# Altium schematic sheet 13-USB_HS.SchDoc
size B; SheetNumber: 13; SheetTotal: 16
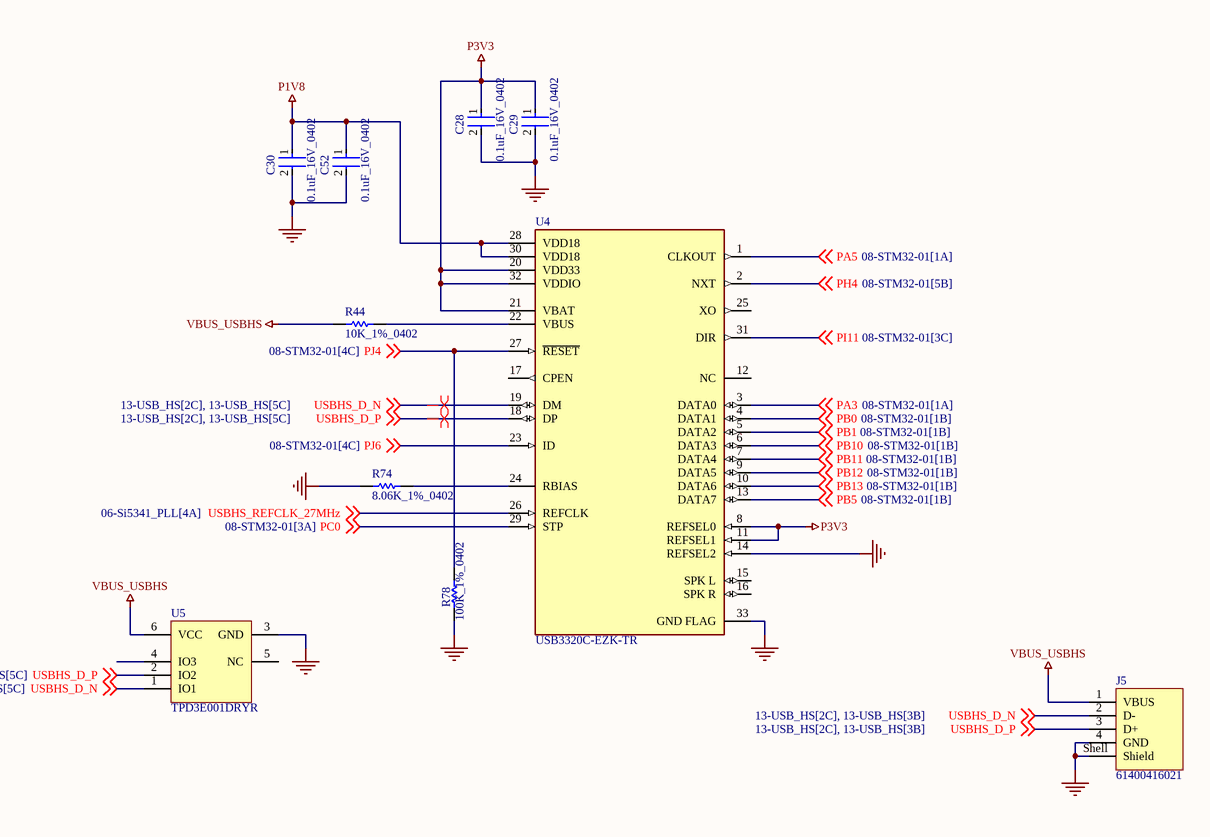
[diagram p0: 13-USB_HS.SchDoc]

## Parts
C28  0.1uF_16V_0402  [FP-C0402-BB-MFG]
C29  0.1uF_16V_0402  [FP-C0402-BB-MFG]
C30  0.1uF_16V_0402  [FP-C0402-BB-MFG]
C52  0.1uF_16V_0402  [FP-C0402-BB-MFG]
J5  61400416021  [61400416021]
R44  10K_1%_0402  [RESC1005X40X25NL10T10]
R74  8.06K_1%_0402  [RESC1005X40X25LL05T05]
R78  100K_1%_0402  [RESC1005X40X25ML05T10]
U4  USB3320C-EZK-TR  [FP-32QFN-3304-5X5B-MFG]
U5  TPD3E001DRYR  [DRY0006A]

## Nets
GND: C28.2 C29.2 C30.2 C52.2 J5.4(GND) J5.Shell(Shield) R74.1 R78.1 U4.14(REFSEL2) U4.33(GND_FLAG) U5.3(GND)
P1V8: C30.1 C52.1 U4.28(VDD18) U4.30(VDD18)
P3V3: C28.1 C29.1 U4.8(REFSEL0) U4.11(REFSEL1) U4.20(VDD33) U4.21(VBAT) U4.32(VDDIO)
VBUS_USBHS: J5.1(VBUS) R44.2 U5.6(VCC)
PA3: U4.3(DATA0) ; off-sheet PA3
PA5: U4.1(CLKOUT) ; off-sheet PA5
PB0: U4.4(DATA1) ; off-sheet PB0
PB1: U4.5(DATA2) ; off-sheet PB1
PB5: U4.13(DATA7) ; off-sheet PB5
PB10: U4.6(DATA3) ; off-sheet PB10
PB11: U4.7(DATA4) ; off-sheet PB11
PB12: U4.9(DATA5) ; off-sheet PB12
PB13: U4.10(DATA6) ; off-sheet PB13
PC0: U4.29(STP) ; off-sheet PC0
PH4: U4.2(NXT) ; off-sheet PH4
PI11: U4.31(DIR) ; off-sheet PI11
PJ4: R78.2 U4.27(~{RESET}) ; off-sheet PJ4
PJ6: U4.23(ID) ; off-sheet PJ6
USBHS_D_N: J5.2(D-) U4.19(DM) U5.1(IO1) ; off-sheet USBHS_D_N
USBHS_D_P: J5.3(D+) U4.18(DP) U5.2(IO2) ; off-sheet USBHS_D_P
USBHS_REFCLK_27MHz: U4.26(REFCLK) ; off-sheet USBHS_REFCLK_27MHz
NetR44_1: R44.1 U4.22(VBUS)
NetR74_2: R74.2 U4.24(RBIAS)

Not connected (* = marked no-connect by the designer): U4 12(NC) 15(SPK_L) 16(SPK_R) 17(CPEN) 25(XO); U5 4(IO3) 5(NC)

## Layout directives
differential pair: USBHS_D_N, USBHS_D_P

## Library data of the parts
C28-C30 C52 = CMP-1034-02068-3: CAP CER 0.1UF 16V 5% X7R 0402; Manufacturer: Kemet; Manufacturer Part Number: C0402C104J4RACTU; Value: 0.10 μF; Temperature Coefficient: 15%; Tolerance: 0.05; Material: Ceramic; ComponentLink2URL: https://content.kemet.com/datasheets/KEM_C1002_X7R_SMD.pdf; Automotive: No; Device Class L2: Capacitors; Temperature: -55°C to +125°C; RoHS: TRUE; Voltage Rating: 16 V; ComponentLink2Description: Datasheet; Device Class L3: Ceramic Capacitors; Temperature Range Low: -55°C; Ipc Land Pattern Name: CAPC10050X50; Device Class L1: Passive Components; Temperature Range High: +125°C; Package: C0402-BB; Capacitance: 0.10 μF; Category: Cap; Mouser Description: CAP CER 0.1UF 16V X7R 0402; Height: 0.55mm; Digikey Description: CAP CER 0.1UF 16V 5% X7R 0402; Octopart: https://octopart.com/c0402c104j4ractu-kemet-12573893; Temperature Characteristic: X7R; Lead Free: Yes
J5 = CMP-1502-03227-2: NexarPartId: 21041530; Contact Resistance: 20mΩ; Gender: Receptacle; Voltage Rating (DC): 30V; Current Rating: 1.5A; Connector Type: USB; Insulation Resistance: 1GΩ; USB Standard: USB 2.0; Number of Contacts: 4; Number of Ports: 1; Width: 14.4mm; REACH SVHC: Unknown; Contact Plating: Gold; Length: 15.8mm; Lead Free: Lead Free; Max Operating Temperature: 105°C; Orientation: Horizontal; Contact Material: Copper; Voltage Rating: 30V; Min Operating Temperature: -40°C; Flammability Rating: UL94 V-0; Color: White; RoHS: Compliant; Number of Pins: 4; Mount: Horizontal, Through Hole; Number of Positions: 4; Operating Supply Voltage: 30V; Insulation Material: PBT; Termination: Solder
R44 = CMP-2002-04694-1: Manufacturer: Bourns; Part Number: CR0402-FX-1002GLF
R74 = CMP-1011-00612-2: Manufacturer: Panasonic; Part Number: ERJ-2RKF8061X
R78 = CMP-2002-07852-1: Manufacturer: Yageo; Part Number: RC0402FR-13100KL
U4 = CMP-0186-00336-2: IC TRANSCEIVER HALF 1/1 32QFN; Manufacturer: Microchip; Min Supply Voltage: 1.6V; Usb Standard: USB 2.0; Max Supply Voltage: 5.5V; Nominal Supply Current: 0.7-29400uA; Number Of Ports: 1; Interface: UART,USB; Standoff Height: 0mm; Digikey Description: IC TRANSCEIVER HALF 1/1 32QFN; Category: IC; Mouser Description: Microchip USB3320C-EZK-TR, USB Transceiver, USB 2.0, 1.8 V, 3.3 V, 32-Pin QFN; Ipc Land Pattern Name: QFN50P500X500X85-32; ComponentLink2Description: Datasheet; Device Class L2: Interface ICs; Temperature Range Low: -40°C; Ambient Temperature Range Low: -40°C; ComponentLink2URL: http://ww1.microchip.com/downloads/en/DeviceDoc/00001792E.pdf; Device Class L3: USB Interface ICs; Lead Free: Yes; RoHS: TRUE; Height: 1mm; Temperature Range High: +85°C; Octopart: https://octopart.com/usb3320c-ezk-tr-microchip-24995468; Device Class L1: Integrated Circuits (ICs); Automotive: No; Temperature: -40°C to +85°C; Ambient Temperature Range High: +85°C; Package: 32QFN-3304-5X5B; Manufacturer Part Number: USB3320C-EZK-TR
U5 = CMP-0326-00032-3: Low-Capacitance + / - 15 kV ESD-Protection Array for High-Speed Data Interfaces, 3 Channels, -40 to +85 degC, 6-pin SON (DRY), Green (RoHS & no Sb/Br); Manufacturer: Texas Instruments; USB High Speed: TRUE; SubFamily: ESD Solution; IO Capacitance(Typ)(pF): 1.5; IEC 61000-4-2 Contact(+/- kV): 8; IO Leakage Current(nA): Jan-00; Breakdown Voltage(Min)(V): 11; IEC 61000-4-2 Air-Gap(+/- kV): 15; DatasheetVersion: SLLS683D; Mounting Technology: Surface Mount; ComponentLink1URL: http://www.ti.com/; PackageReference: DRY0006A; ComponentLink2URL: http://www.ti.com/general/docs/lit/getliterature.tsp?genericPartNumber=TPD3E001&fileType=pdf; ComponentLink2Description: Datasheet; ComponentLink3Description: URL Link1; PackageDescription: 6-Pin Plastic Small Outline No-Lead, 1 x 1.45 x 0.6 mm Body, 0.5 mm Pitch; ComponentLink1Description: Manufacturer URL; PackageVersion: revF, Dec-2011; PartNumber: TPD3E001DRYR; Eco-Plan: Green (RoHS & no Sb/Br); ComponentLink3URL: SamplesURL:http://www.ti.com/product/tpd3e001#samples